# Altium schematic sheet Display.SchDoc: Display
size A4; CheckedBy: Ari Wasch; Engineer: Josh Harper; Revision: 03; SheetNumber: 4; SheetTotal: 6
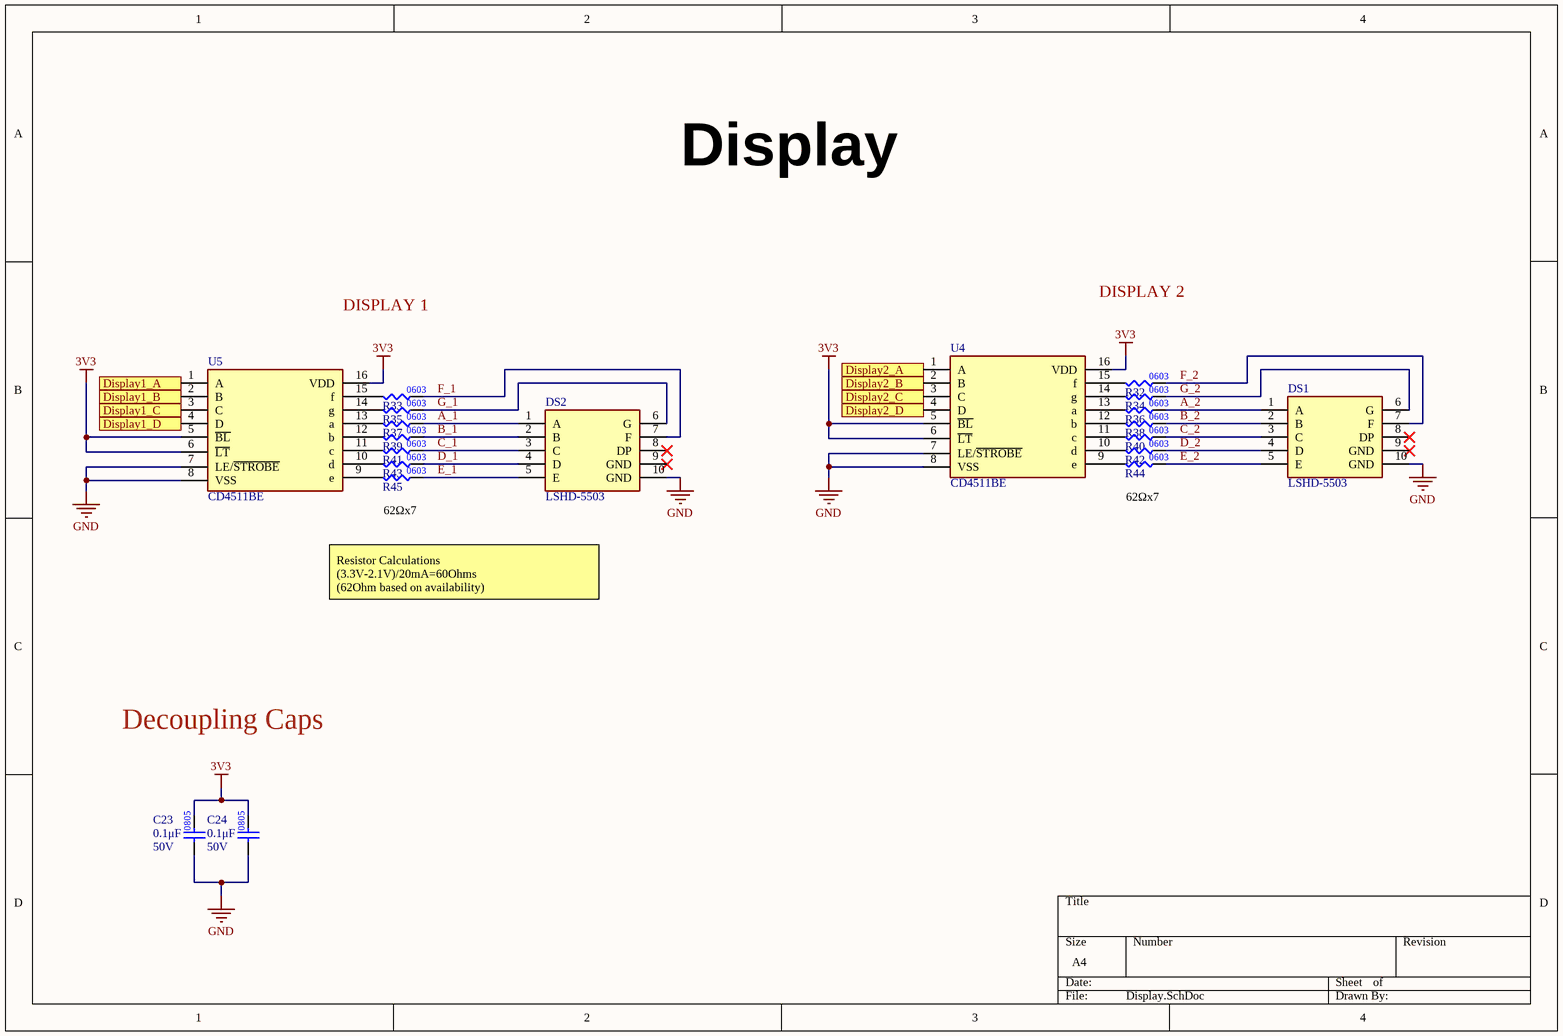
[diagram p0: Display.SchDoc]

## Parts
C23  value 0.1μF  Voltage Rating: 50V  [CAP2012]  (hidden comment: CAP_0.1uF_50V_0805)
C24  value 0.1μF  Voltage Rating: 50V  [CAP2012]  (hidden comment: CAP_0.1uF_50V_0805)
DS1  LSHD-5503  [DIPS1524W50P254L1240H825Q10N]
DS2  LSHD-5503  [DIPS1524W50P254L1240H825Q10N]
R32  RES_62Ω_0603_1%  (value not drawn)
R33  RES_62Ω_0603_1%  (value not drawn)
R34  RES_62Ω_0603_1%  (value not drawn)
R35  RES_62Ω_0603_1%  (value not drawn)
R36  RES_62Ω_0603_1%  (value not drawn)
R37  RES_62Ω_0603_1%  (value not drawn)
R38  RES_62Ω_0603_1%  (value not drawn)
R39  RES_62Ω_0603_1%  (value not drawn)
R40  RES_62Ω_0603_1%  (value not drawn)
R41  RES_62Ω_0603_1%  (value not drawn)
R42  RES_62Ω_0603_1%  (value not drawn)
R43  RES_62Ω_0603_1%  (value not drawn)
R44  RES_62Ω_0603_1%  (value not drawn)
R45  RES_62Ω_0603_1%  (value not drawn)
U4  CD4511BE  [DIP794W53P254L1930H508Q16N]
U5  CD4511BE  [DIP794W53P254L1930H508Q16N]

## Ports
Display1_A (in), Display1_B (in), Display1_C (in), Display1_D (in), Display2_A (in), Display2_B (in), Display2_C (in), Display2_D (in)

## Nets
3V3: C23.2 C24.2 U4.5(~{BL}) U4.6(~{LT}) U4.16(VDD) U5.5(~{BL}) U5.6(~{LT}) U5.16(VDD)
GND: C23.1 C24.1 DS1.10(GND) DS2.10(GND) U4.7(LE/~{STROBE}) U4.8(VSS) U5.7(LE/~{STROBE}) U5.8(VSS)
A_1: DS2.1(A) R37.2
A_2: DS1.1(A) R36.2
B_1: DS2.2(B) R39.2
B_2: DS1.2(B) R38.2
C_1: DS2.3(C) R41.2
C_2: DS1.3(C) R40.2
D_1: DS2.4(D) R43.2
D_2: DS1.4(D) R42.2
Display1_A: U5.1(A) ; port Display1_A
Display1_B: U5.2(B) ; port Display1_B
Display1_C: U5.3(C) ; port Display1_C
Display1_D: U5.4(D) ; port Display1_D
Display2_A: U4.1(A) ; port Display2_A
Display2_B: U4.2(B) ; port Display2_B
Display2_C: U4.3(C) ; port Display2_C
Display2_D: U4.4(D) ; port Display2_D
E_1: DS2.5(E) R45.2
E_2: DS1.5(E) R44.2
F_1: DS2.7(F) R33.2
F_2: DS1.7(F) R32.2
G_1: DS2.6(G) R35.2
G_2: DS1.6(G) R34.2
NetR32_1: R32.1 U4.15(f)
NetR33_1: R33.1 U5.15(f)
NetR34_1: R34.1 U4.14(g)
NetR35_1: R35.1 U5.14(g)
NetR36_1: R36.1 U4.13(a)
NetR37_1: R37.1 U5.13(a)
NetR38_1: R38.1 U4.12(b)
NetR39_1: R39.1 U5.12(b)
NetR40_1: R40.1 U4.11(c)
NetR41_1: R41.1 U5.11(c)
NetR42_1: R42.1 U4.10(d)
NetR43_1: R43.1 U5.10(d)
NetR44_1: R44.1 U4.9(e)
NetR45_1: R45.1 U5.9(e)

Not connected (* = marked no-connect by the designer): DS1 8(DP)* 9(GND)*; DS2 8(DP)* 9(GND)*

## Notes on the sheet
- Display
- DISPLAY 1
- DISPLAY 2
- 62Ωx7
- Resistor Calculations
  (3.3V-2.1V)/20mA=60Ohms
  (62Ohm based on availability)
- Decoupling Caps

## Library data of the parts
C23 C24 = CAP_0.1uF_50V_0805: CAP CER 0.1UF 50V X7R 0805; Manufacturer Part Number 1: GCM21BR71H104KA37K; Manufacturer 1: Murata Electronics; Package/Footprint: 0805; Supplier Part Number 1: 490-8049-1-ND; Supplier 1: Digi-Key; Dielectric: X7R; LCSC Part #: C49678; Mounting Type: SMD
DS1 DS2 = LSHD-5503: DISPLAY 7SEG 0.56" SGL RED 10DIP; Manufacturer_Name: Lite-On; Datasheet Link: https://componentsearchengine.com/Datasheets/1/LSHD-5503.pdf; Height: 8.25mm; Mouser Part Number: 859-LSHD-5503; Mouser Price/Stock: https://www.mouser.com/Search/Refine.aspx?Keyword=859-LSHD-5503; Arrow Part Number: LSHD-5503; Arrow Price/Stock: https://www.arrow.com/en/products/lshd-5503/lite-on-technology; Supplier Link: https://www.digikey.ca/en/products/detail/lite-on-inc/LSHD-5503/560009; Manufacturer Part Number 1: LSHD-5503
R32-R45 = RES_62Ω_0603_1%: RES 62 OHM 1% 1/10W 0603; Manufacturer: Vishay; Manufacturer Part Number 1: CRCW060362R0FKEA; Value: 62Ω; Supplier 1: Digi-Key; Supplier Part Number 1: 541-62.0HCT-ND; Package: 0603
U4 U5 = CD4511BE: Integrated Circuit; Manufacturer_Name: Texas Instruments; Datasheet Link: http://www.ti.com/lit/gpn/cd4511b; Height: 5.08mm; Mouser Part Number: 595-CD4511BE; Mouser Price/Stock: https://www.mouser.co.uk/ProductDetail/Texas-Instruments/CD4511BE?qs=pt%2FIv5r0EPdhGGYgwfpYEw%3D%3D; Arrow Part Number: CD4511BE; Arrow Price/Stock: https://www.arrow.com/en/products/cd4511be/texas-instruments?region=nac; Manufacturer Part Number 1: CD4511BE